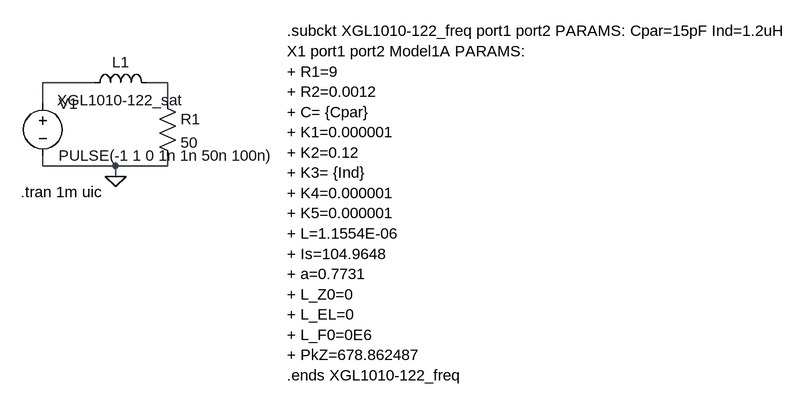
[diagram p0: schematic Draft1.asc]
Draft1.asc, the LTspice schematic file:
Version 4
SHEET 1 1328 680
WIRE 192 160 112 160
WIRE 304 160 272 160
WIRE 112 192 112 160
WIRE 304 192 304 160
WIRE 112 288 112 272
WIRE 224 288 112 288
WIRE 304 288 304 272
WIRE 304 288 224 288
WIRE 224 304 224 288
FLAG 224 304 0
SYMBOL res 288 176 R0
SYMATTR InstName R1
SYMATTR Value 50
SYMBOL voltage 112 176 R0
WINDOW 123 0 0 Left 0
WINDOW 39 0 0 Left 0
SYMATTR InstName V1
SYMATTR Value PULSE(-1 1 0 1n 1n 50n 100n)
SYMBOL ind 176 176 R270
WINDOW 0 32 56 VTop 2
WINDOW 3 5 56 VBottom 2
SYMATTR InstName L1
SYMATTR Value XGL1010-122_sat
TEXT 78 328 Left 2 !.tran 1m uic
TEXT 488 80 Left 2 !.subckt XGL1010-122_freq port1 port2 PARAMS: Cpar=15pF Ind=1.2uH\nX1 port1 port2 Model1A PARAMS:\n+ R1=9\n+ R2=0.0012\n+ C= {Cpar}\n+ K1=0.000001\n+ K2=0.12\n+ K3= {Ind}\n+ K4=0.000001\n+ K5=0.000001\n+ L=1.1554E-06\n+ Is=104.9648\n+ a=0.7731\n+ L_Z0=0\n+ L_EL=0\n+ L_F0=0E6\n+ PkZ=678.862487\n.ends XGL1010-122_freq

The netlist it stands for:
* Draft1.asc
R1 N002 0 50
V1 N001 0 PULSE(-1 1 0 1n 1n 50n 100n)
L1 N001 N002 XGL1010-122_sat
.tran 1m uic
.subckt XGL1010-122_freq port1 port2 PARAMS: Cpar=15pF Ind=1.2uH
X1 port1 port2 Model1A PARAMS:
+ R1=9
+ R2=0.0012
+ C= {Cpar}
+ K1=0.000001
+ K2=0.12
+ K3= {Ind}
+ K4=0.000001
+ K5=0.000001
+ L=1.1554E-06
+ Is=104.9648
+ a=0.7731
+ L_Z0=0
+ L_EL=0
+ L_F0=0E6
+ PkZ=678.862487
.ends XGL1010-122_freq
.backanno
.end